# Altium project Makit_Car_Kit.PrjPcb (part 2 of 3)
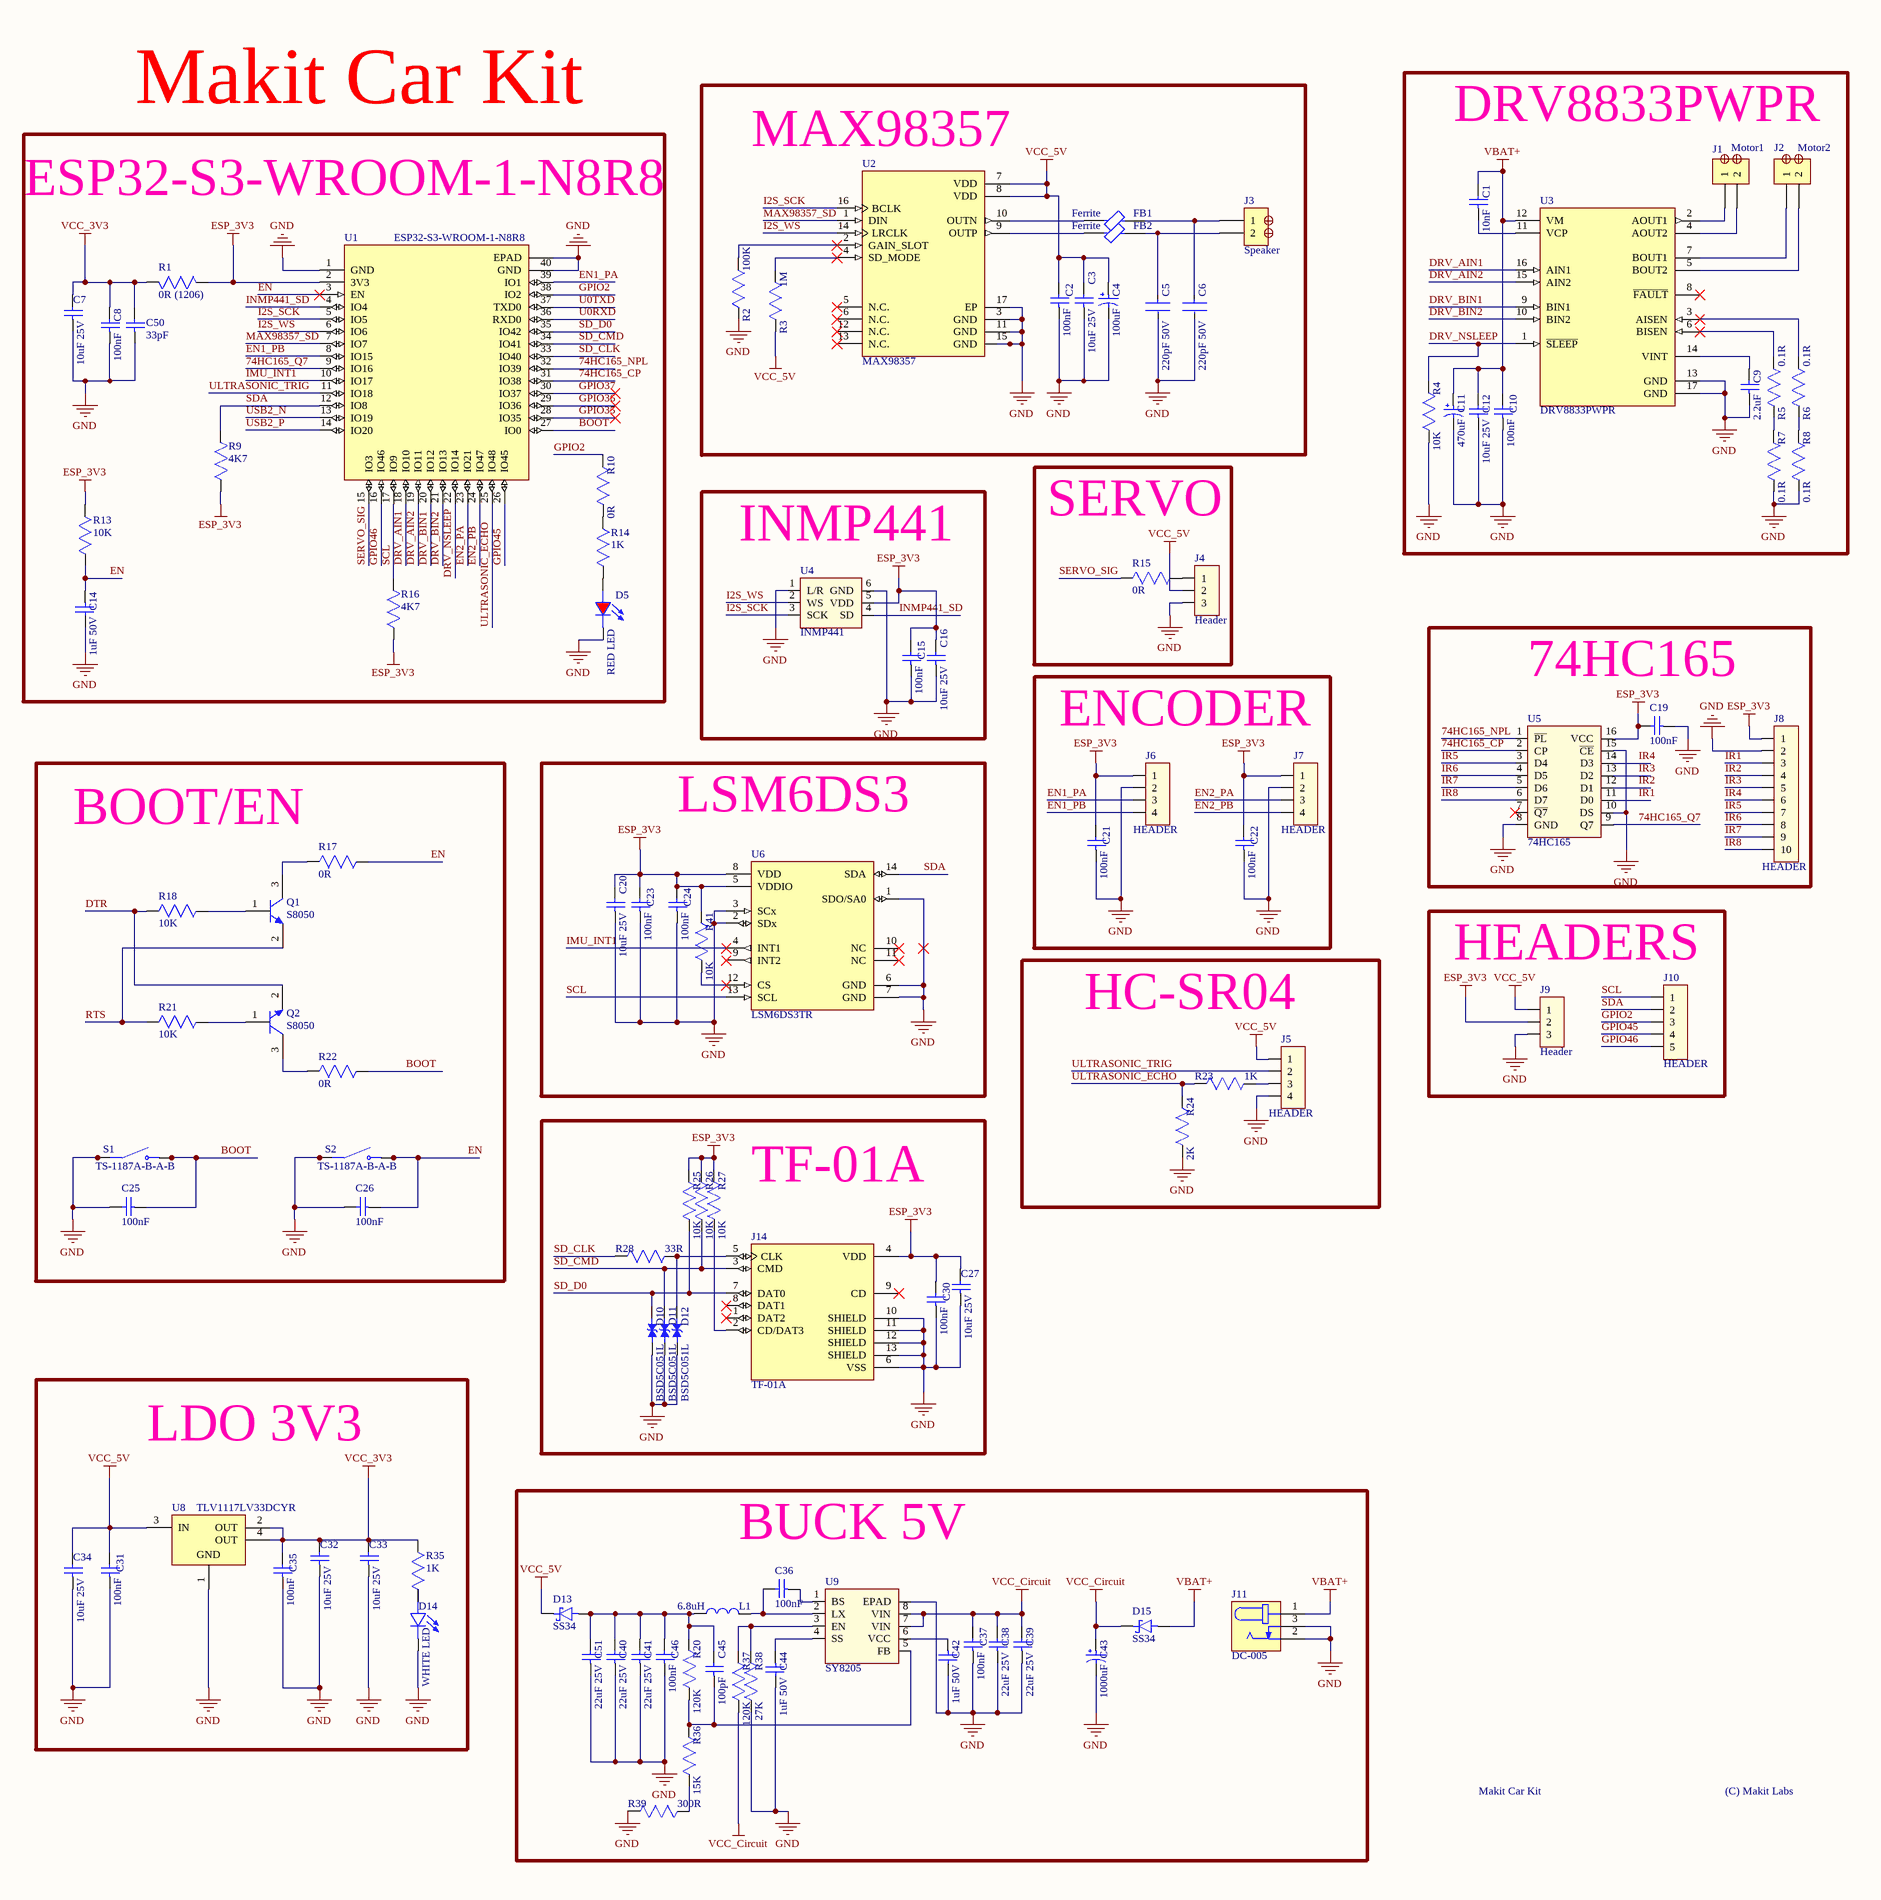
[diagram p2: Makit_Car_Kit.SchDoc, right]

## Sheet Makit_Car_Kit.SchDoc (continued)
### Library data of the parts
C1 = 0603B103K500NT: Ceramic Capacitor, Multilayer, Ceramic, 50V, 10% +Tol, 10% -Tol, X7R, 15% TC, 0.01uF, Surface Mount, 0603; Manufacturer: Knowles; Supplier: Mouser; Supplier Part Number: 843-0603B103K500NT; Manufacturer Part Number: 0603B103K500NT; Category: Ceramic Capacitors; Stock: 11050; Pricing: 1=1.01, 10=0.507, 50=0.507, 100=0.463, 1000=0.365, 10000=0.303 (USD); Value: 10nF; China RoHS: Non-Compliant; Country of Origin: Mainland China, USA; Dielectric Material: Ceramic; Export Control Classification Number (ECCN) Code: EAR99; Height: 889µm; Harmonized Tariff Schedule (HTS) Code: 8532.24.00.20; Introduction Date: 2006-04-10; Length: 1.52mm; Lifecycle Status: Production; Max Operating Temperature: 125°C; Min Operating Temperature: -55°C; Mounting Technology: Surface Mount; Number of Terminals: 2; REACH SVHC: No; RoHS: Non-Compliant; Voltage Rating (DC): 50V; Width: 762µm; ComponentLink1URL: https://datasheet.octopart.com:443/0603B103K500NT-Knowles-datasheet-136501453.pdf?src-supplier=RFMW; ComponentLink1Description: https://datasheet.octopart.com:443/0603B103K500NT-Knowles-datasheet-136501453.pdf?src-supplier=RFMW; ComponentLink2URL: https://datasheet.octopart.com:443/0603B103K500NT-Knowles-datasheet-137194379.pdf?src-supplier=Component+Distributors+Inc.; ComponentLink2Description: https://datasheet.octopart.com:443/0603B103K500NT-Knowles-datasheet-137194379.pdf?src-supplier=Component+Distributors+Inc.; ComponentLink3URL: https://datasheet.octopart.com:443/0603B103K500NT-Knowles-datasheet-23628174.pdf?src-supplier=Component+Distributors+Inc.; ComponentLink3Description: https://datasheet.octopart.com:443/0603B103K500NT-Knowles-datasheet-23628174.pdf?src-supplier=Component+Distributors+Inc.; Package: 0603; JLCPCB Part Number: C57112
C2 C8 C10 C15 C17-C19 C21-C26 C30 C31 C35-C37 C46 = CC0603KRX7R9BB104: Multilayer Ceramic Capacitor, CC Series, 0.1 - F, - 10%, X7R, 50 V, 0603 [1608 Metric]; Manufacturer: Yageo Group; Voltage: 50V; Supplier: Avnet; Supplier Part Number: CC0603KRX7R9BB104; Manufacturer Part Number: CC0603KRX7R9BB104; RoHS: Compliant; Category: Ceramic Capacitors; Stock: 6088000; Pricing: 4000=0.00582, 8000=0.00559, 16000=0.00541, 32000=0.00522, 64000=0.00504 (USD); Value: 100nF; Case/Package: 0603; Case Code (Imperial): 0603; Case Code (Metric): 1608; China RoHS: Compliant; Country of Origin: Mainland China, Taiwan; Depth: 800µm; Dielectric: X7R; Dielectric Material: Ceramic; Export Control Classification Number (ECCN) Code: EAR99; Halogen Free: Halogen Free; Height: 800µm; Harmonized Tariff Schedule (HTS) Code: 8532.24.00.20; Introduction Date: 2005-08-18; Lead Free: Lead Free; Length: 1.6mm; Lifecycle Status: Production; Material: Ceramic; Max Operating Temperature: 125°C; Min Operating Temperature: -55°C; Mounting Technology: Surface Mount; Pins: 2; Number of Terminals: 2; Radiation Hardening: No; REACH SVHC: Yes; Schedule B: 8532240020, 8532240020|8532240020, 8532240020|8532240020|8532240020, 8532240020|8532240020|8532240020|8532240020; Termination: SMD/SMT; Thickness: 889µm; Tolerance: 10%; Voltage Rating: 50V; Voltage Rating (DC): 50V; Width: 800µm; ComponentLink1URL: https://datasheet.octopart.com:443/CC0603KRX7R9BB104-Yageo-datasheet-177165144.pdf?src-supplier=IHS; ComponentLink1Description: https://datasheet.octopart.com:443/CC0603KRX7R9BB104-Yageo-datasheet-177165144.pdf?src-supplier=IHS; ComponentLink2URL: https://datasheet.octopart.com:443/CC0603KRX7R9BB104-Yageo-datasheet-82288757.pdf?src-supplier=Upverter; ComponentLink2Description: https://datasheet.octopart.com:443/CC0603KRX7R9BB104-Yageo-datasheet-82288757.pdf?src-supplier=Upverter; ComponentLink3URL: https://datasheet.octopart.com:443/CC0603KRX7R9BB104-Yageo-datasheet-68298032.pdf?src-supplier=Upverter; ComponentLink3Description: https://datasheet.octopart.com:443/CC0603KRX7R9BB104-Yageo-datasheet-68298032.pdf?src-supplier=Upverter; ComponentLink4URL: https://datasheet.octopart.com:443/CC0603KRX7R9BB104-Yageo-Group-datasheet-189192896.pdf?src-supplier=Future+Electronics; ComponentLink4Description: https://datasheet.octopart.com:443/CC0603KRX7R9BB104-Yageo-Group-datasheet-189192896.pdf?src-supplier=Future+Electronics; ComponentLink5URL: https://datasheet.octopart.com:443/CC0603KRX7R9BB104-Yageo-datasheet-12526321.pdf?src-supplier=Future+Electronics; ComponentLink5Description: https://datasheet.octopart.com:443/CC0603KRX7R9BB104-Yageo-datasheet-12526321.pdf?src-supplier=Future+Electronics; ComponentLink6URL: https://datasheet.octopart.com:443/CC0603KRX7R9BB104-Yageo-datasheet-166511530.pdf?src-supplier=Future+Electronics; ComponentLink6Description: https://datasheet.octopart.com:443/CC0603KRX7R9BB104-Yageo-datasheet-166511530.pdf?src-supplier=Future+Electronics; ComponentLink7URL: https://datasheet.octopart.com:443/CC0603KRX7R9BB104-Yageo-datasheet-137700082.pdf?src-supplier=Future+Electronics; ComponentLink7Description: https://datasheet.octopart.com:443/CC0603KRX7R9BB104-Yageo-datasheet-137700082.pdf?src-supplier=Future+Electronics; ComponentLink8URL: https://datasheet.octopart.com:443/CC0603KRX7R9BB104-Yageo-datasheet-137700084.pdf?src-supplier=Future+Electronics; ComponentLink8Description: https://datasheet.octopart.com:443/CC0603KRX7R9BB104-Yageo-datasheet-137700084.pdf?src-supplier=Future+Electronics; ComponentLink9URL: https://datasheet.octopart.com:443/CC0603KRX7R9BB104-Yageo-datasheet-27626582.pdf?src-supplier=Future+Electronics; ComponentLink9Description: https://datasheet.octopart.com:443/CC0603KRX7R9BB104-Yageo-datasheet-27626582.pdf?src-supplier=Future+Electronics; ComponentLink10URL: https://datasheet.octopart.com:443/CC0603KRX7R9BB104-Yageo-datasheet-15895757.pdf?src-supplier=Future+Electronics; ComponentLink10Description: https://datasheet.octopart.com:443/CC0603KRX7R9BB104-Yageo-datasheet-15895757.pdf?src-supplier=Future+Electronics; ComponentLink11URL: https://datasheet.octopart.com:443/CC0603KRX7R9BB104-Yageo-datasheet-8324192.pdf?src-supplier=Future+Electronics; ComponentLink11Description: https://datasheet.octopart.com:443/CC0603KRX7R9BB104-Yageo-datasheet-8324192.pdf?src-supplier=Future+Electronics; ComponentLink12URL: https://datasheet.octopart.com/CC0603KRX7R9BB104-Yageo-datasheet-10883670.pdf; ComponentLink12Description: https://datasheet.octopart.com/CC0603KRX7R9BB104-Yageo-datasheet-10883670.pdf; ComponentLink13URL: https://datasheet.octopart.com:443/CC0603KRX7R9BB104-Yageo-datasheet-181968726.pdf?src-supplier=Newark; ComponentLink13Description: https://datasheet.octopart.com:443/CC0603KRX7R9BB104-Yageo-datasheet-181968726.pdf?src-supplier=Newark; ComponentLink14URL: https://datasheet.octopart.com:443/CC0603KRX7R9BB104-Yageo-datasheet-499490.pdf?src-supplier=Newark; ComponentLink14Description: https://datasheet.octopart.com:443/CC0603KRX7R9BB104-Yageo-datasheet-499490.pdf?src-supplier=Newark; ComponentLink15URL: https://datasheet.octopart.com:443/CC0603KRX7R9BB104-Yageo-datasheet-62336348.pdf?src-supplier=Newark; ComponentLink15Description: https://datasheet.octopart.com:443/CC0603KRX7R9BB104-Yageo-datasheet-62336348.pdf?src-supplier=Newark; ComponentLink16URL: https://datasheet.octopart.com:443/CC0603KRX7R9BB104-Yageo-datasheet-147453679.pdf?src-supplier=Newark; ComponentLink16Description: https://datasheet.octopart.com:443/CC0603KRX7R9BB104-Yageo-datasheet-147453679.pdf?src-supplier=Newark; ComponentLink17URL: https://datasheet.octopart.com:443/CC0603KRX7R9BB104-Yageo-datasheet-151948686.pdf?src-supplier=Farnell; ComponentLink17Description: https://datasheet.octopart.com:443/CC0603KRX7R9BB104-Yageo-datasheet-151948686.pdf?src-supplier=Farnell; ComponentLink18URL: https://datasheet.octopart.com:443/CC0603KRX7R9BB104-Yageo-datasheet-500777.pdf?src-supplier=Farnell; ComponentLink18Description: https://datasheet.octopart.com:443/CC0603KRX7R9BB104-Yageo-datasheet-500777.pdf?src-supplier=Farnell; ComponentLink19URL: https://datasheet.octopart.com:443/CC0603KRX7R9BB104-Yageo-datasheet-178019014.pdf?src-supplier=Burklin+Elektronik; ComponentLink19Description: https://datasheet.octopart.com:443/CC0603KRX7R9BB104-Yageo-datasheet-178019014.pdf?src-supplier=Burklin+Elektronik; ComponentLink20URL: https://datasheet.octopart.com:443/CC0603KRX7R9BB104-Yageo-Group-datasheet-165992755.pdf?src-supplier=ODG+(Origin+Data+Global); ComponentLink20Description: https://datasheet.octopart.com:443/CC0603KRX7R9BB104-Yageo-Group-datasheet-165992755.pdf?src-supplier=ODG+(Origin+Data+Global); ComponentLink21URL: https://datasheet.octopart.com:443/CC0603KRX7R9BB104-Yageo-datasheet-140260305.pdf?src-supplier=SOS+electronic; ComponentLink21Description: https://datasheet.octopart.com:443/CC0603KRX7R9BB104-Yageo-datasheet-140260305.pdf?src-supplier=SOS+electronic; ComponentLink22URL: https://datasheet.octopart.com:443/CC0603KRX7R9BB104-Yageo-datasheet-120101875.pdf?src-supplier=Megastar; ComponentLink22Description: https://datasheet.octopart.com:443/CC0603KRX7R9BB104-Yageo-datasheet-120101875.pdf?src-supplier=Megastar; ComponentLink23URL: https://datasheet.octopart.com:443/CC0603KRX7R9BB104-Yageo-datasheet-8701427.pdf?src-supplier=element14; ComponentLink23Description: https://datasheet.octopart.com:443/CC0603KRX7R9BB104-Yageo-datasheet-8701427.pdf?src-supplier=element14; ComponentLink24URL: https://datasheet.octopart.com:443/CC0603KRX7R9BB104-Yageo-datasheet-5301394.pdf?src-supplier=element14; ComponentLink24Description: https://datasheet.octopart.com:443/CC0603KRX7R9BB104-Yageo-datasheet-5301394.pdf?src-supplier=element14; ComponentLink25URL: https://datasheet.octopart.com:443/CC0603KRX7R9BB104-Yageo-datasheet-17600895.pdf?src-supplier=TME; ComponentLink25Description: https://datasheet.octopart.com:443/CC0603KRX7R9BB104-Yageo-datasheet-17600895.pdf?src-supplier=TME; ComponentLink26URL: http://sigma.octopart.com:80/15889575/rohs_statement/Yageo-CC0603KRX7R9BB104.pdf?src-supplier=Compliance+Statements; ComponentLink26Description: http://sigma.octopart.com:80/15889575/rohs_statement/Yageo-CC0603KRX7R9BB104.pdf?src-supplier=Compliance+Statements; ComponentLink27URL: http://sigma.octopart.com:80/conflict_mineral_statement/Yageo-company-3.pdf?src-supplier=Compliance+Statements; ComponentLink27Description: http://sigma.octopart.com:80/conflict_mineral_statement/Yageo-company-3.pdf?src-supplier=Compliance+Statements; JLCPCB Part Number: C14663
C3 C7 C12 C13 C16 C20 C27 C28 C32-C34 = CL10A106MA8NRNC: 25V 10uF X5R ±20% 0603 Multilayer Ceramic Capacitors MLCC - SMD/SMT ROHS; Manufacturer: Samsung Electro-Mechanics; Value: 10µF; Supplier: Avnet; Supplier Part Number: CL10A106MA8NRNC; Manufacturer Part Number: CL10A106MA8NRNC; RoHS: Compliant; Category: Ceramic Capacitors; Stock: 6860000; Pricing: 4000=0.03585, 8000=0.03513, 16000=0.03443, 32000=0.03377, 64000=0.03313 (USD); Case/Package: 0603; Case Code (Imperial): 0603; Case Code (Metric): 1608; China RoHS: Compliant; Contact Plating: Tin; Country of Origin: Mainland China, Philippines, South Korea; Dielectric: X5R; Dielectric Material: Ceramic; Export Control Classification Number (ECCN) Code: EAR99; Height: 800µm; Harmonized Tariff Schedule (HTS) Code: 8532.24.00.20; Introduction Date: 2013-01-16; Lead Free: Lead Free; Length: 1.6mm; Lifecycle Status: Production; Material: Ceramic; Max Operating Temperature: 85°C; Min Operating Temperature: -55°C; Mounting Technology: Surface Mount; Number of Terminals: 2; Packaging: Tape & Reel (TR); REACH SVHC: Yes; Schedule B: 8532240020, 8532240020|8532240020|8532240020|8532240020|8532240020|8532240020|8532240020|8532240020|8532240020|8532240020|8532240020, 8532240020|8532240020|8532240020|8532240020|8532240020|8532240020|8532240020|8532240020|8532240020|8532240020|8532240020|8532240020, 8532240020|8532240020|8532240020|8532240020|8532240020|8532240020|8532240020|8532240020|8532240020|8532240020|8532240020|8532240020|8532240020; Termination: Wraparound; Thickness: 889µm; Tolerance: 20%; Voltage Rating: 25V; Voltage Rating (DC): 25V; Width: 800µm; ComponentLink1URL: https://datasheet.octopart.com:443/CL10A106MA8NRNC-Samsung-Electro-Mechanics-datasheet-182019172.pdf?src-supplier=IHS; ComponentLink1Description: https://datasheet.octopart.com:443/CL10A106MA8NRNC-Samsung-Electro-Mechanics-datasheet-182019172.pdf?src-supplier=IHS; ComponentLink2URL: https://datasheet.octopart.com:443/CL10A106MA8NRNC-Samsung-Electro-Mechanics-datasheet-137745063.pdf?src-supplier=Future+Electronics; ComponentLink2Description: https://datasheet.octopart.com:443/CL10A106MA8NRNC-Samsung-Electro-Mechanics-datasheet-137745063.pdf?src-supplier=Future+Electronics; ComponentLink3URL: https://datasheet.octopart.com:443/CL10A106MA8NRNC-Samsung-Electro-Mechanics-datasheet-136031756.pdf?src-supplier=Future+Electronics; ComponentLink3Description: https://datasheet.octopart.com:443/CL10A106MA8NRNC-Samsung-Electro-Mechanics-datasheet-136031756.pdf?src-supplier=Future+Electronics; ComponentLink4URL: https://datasheet.octopart.com:443/CL10A106MA8NRNC-Samsung-Electro-Mechanics-datasheet-110226291.pdf?src-supplier=Future+Electronics; ComponentLink4Description: https://datasheet.octopart.com:443/CL10A106MA8NRNC-Samsung-Electro-Mechanics-datasheet-110226291.pdf?src-supplier=Future+Electronics; ComponentLink5URL: https://datasheet.octopart.com:443/CL10A106MA8NRNC-Samsung-Electro-Mechanics-datasheet-87580073.pdf?src-supplier=Future+Electronics; ComponentLink5Description: https://datasheet.octopart.com:443/CL10A106MA8NRNC-Samsung-Electro-Mechanics-datasheet-87580073.pdf?src-supplier=Future+Electronics; ComponentLink6URL: https://datasheet.octopart.com:443/CL10A106MA8NRNC-Samsung-Electro-Mechanics-datasheet-68300265.pdf?src-supplier=Future+Electronics; ComponentLink6Description: https://datasheet.octopart.com:443/CL10A106MA8NRNC-Samsung-Electro-Mechanics-datasheet-68300265.pdf?src-supplier=Future+Electronics; ComponentLink7URL: https://datasheet.octopart.com:443/CL10A106MA8NRNC-Samsung-datasheet-66660282.pdf?src-supplier=Future+Electronics; ComponentLink7Description: https://datasheet.octopart.com:443/CL10A106MA8NRNC-Samsung-datasheet-66660282.pdf?src-supplier=Future+Electronics; ComponentLink8URL: https://datasheet.octopart.com:443/CL10A106MA8NRNC-Samsung-datasheet-48647236.pdf?src-supplier=Future+Electronics; ComponentLink8Description: https://datasheet.octopart.com:443/CL10A106MA8NRNC-Samsung-datasheet-48647236.pdf?src-supplier=Future+Electronics; ComponentLink9URL: https://datasheet.octopart.com:443/CL10A106MA8NRNC-Samsung-datasheet-39118733.pdf?src-supplier=Future+Electronics; ComponentLink9Description: https://datasheet.octopart.com:443/CL10A106MA8NRNC-Samsung-datasheet-39118733.pdf?src-supplier=Future+Electronics; ComponentLink10URL: https://datasheet.octopart.com:443/CL10A106MA8NRNC-Samsung-Electro-Mechanics-datasheet-149156483.pdf?src-supplier=Future+Electronics; ComponentLink10Description: https://datasheet.octopart.com:443/CL10A106MA8NRNC-Samsung-Electro-Mechanics-datasheet-149156483.pdf?src-supplier=Future+Electronics; JLCPCB Part Number: C96446
C4 = ERS1EM101E11OT: 100uF 25V ±20% Plugin, D6.3xL11mm Aluminum Electrolytic Capacitors - Leaded ROHS; Manufacturer: AISHI; Value: 100µF; Leakage Current: 25µA; Ripple Current: 140mA; Supplier: Future Electronics; Supplier Part Number: 1125307; Manufacturer Part Number: ERS1EM101E11OT; RoHS: Compliant; Category: Aluminum Electrolytic Capacitors; Pricing: 1000=0.0251, 5000=0.0242, 12500=0.0238, 37500=0.0232, 75000=0.0224 (USD); Diameter: 6.3mm; Length: 11mm; Max Operating Temperature: 105°C; Min Operating Temperature: -40°C; Number of Terminals: 2; Packaging: Bulk; REACH SVHC: Yes; Terminal Pitch: 2.5mm; Voltage Rating (DC): 25V; ComponentLink1URL: https://datasheet.octopart.com:443/ERS1EM101E11OT-AISHI-datasheet-182031447.pdf?src-supplier=IHS; ComponentLink1Description: https://datasheet.octopart.com:443/ERS1EM101E11OT-AISHI-datasheet-182031447.pdf?src-supplier=IHS; ComponentLink2URL: https://datasheet.octopart.com:443/ERS1EM101E11OT-AISHI-datasheet-153668799.pdf?src-supplier=Master+Electronics; ComponentLink2Description: https://datasheet.octopart.com:443/ERS1EM101E11OT-AISHI-datasheet-153668799.pdf?src-supplier=Master+Electronics; ComponentLink3URL: https://datasheet.octopart.com:443/ERS1EM101E11OT-AISHI-datasheet-141413433.pdf?src-supplier=Future+Electronics; ComponentLink3Description: https://datasheet.octopart.com:443/ERS1EM101E11OT-AISHI-datasheet-141413433.pdf?src-supplier=Future+Electronics
C5 C6 = CMP-13271-000087-1: Cap Ceramic 220pF 50V X7R ±10% Pad SMD 0603 +125°C T/R; Voltage Rating: 50V; Case Code (Metric): 1608; Radiation Hardening: No; Dielectric: X7R; Mount: Surface Mount; Length: 1.6mm; Thickness: 0.035inch; Packaging: Tape and Reel; Height: 0.8mm; Depth: 0.8mm; Tolerance: 10%; Width: 0.031inch; Case Code (Imperial): 0603; Voltage: 50V; Material: Ceramic; Case/Package: 0603; Capacitance: 220pF; Max Operating Temperature: 125°C; Min Operating Temperature: -55°C; Contact Plating: Tin; JLCPCB Part Number: C1603
C9 C47 = CL10A225KO8NNNC: 16V 2.2uF X5R ±10% 0603 Multilayer Ceramic Capacitors MLCC - SMD/SMT ROHS; Manufacturer: Samsung Electro-Mechanics; Value: 2.2µF; Supplier: Avnet; Supplier Part Number: CL10A225KO8NNNC; Manufacturer Part Number: CL10A225KO8NNNC; RoHS: Compliant; Category: Ceramic Capacitors; Stock: 260000; Pricing: 4000=0.00673, 8000=0.0066, 16000=0.00647, 32000=0.00635, 64000=0.00624 (USD); Case/Package: 0603; Case Code (Imperial): 0603; Case Code (Metric): 1608; China RoHS: Compliant; Contact Plating: Tin; Country of Origin: Mainland China, Philippines, South Korea; Depth: 800µm; Dielectric: X5R; Dielectric Material: Ceramic; Export Control Classification Number (ECCN) Code: EAR99; Height: 900µm; Harmonized Tariff Schedule (HTS) Code: 8532.24.00.20; Introduction Date: 2007-03-23; Lead Free: Lead Free; Length: 1.6mm; Lifecycle Status: Production; Material: Ceramic; Max Operating Temperature: 85°C; Min Operating Temperature: -55°C; Mounting Technology: Surface Mount; Number of Terminals: 2; Radiation Hardening: No; REACH SVHC: Yes; Schedule B: 8532240020, 8532240020|8532240020|8532240020|8532240020|8532240020|8532240020|8532240020|8532240020|8532240020|8532240020|8532240020|8532240020|8532240020|8532240020|8532240020|8532240020|8532240020|8532240020|8532240020|8532240020|8532240020|8532240020|8532240020|85; Thickness: 889µm; Tolerance: 10%; Voltage: 16V; Voltage Rating: 16V; Voltage Rating (DC): 16V; Width: 800µm; ComponentLink1URL: https://datasheet.octopart.com:443/CL10A225KO8NNNC-Samsung-Electro-Mechanics-datasheet-136031763.pdf?src-supplier=IHS; ComponentLink1Description: https://datasheet.octopart.com:443/CL10A225KO8NNNC-Samsung-Electro-Mechanics-datasheet-136031763.pdf?src-supplier=IHS; ComponentLink2URL: https://datasheet.octopart.com/CL10A225KO8NNNC-Samsung-Electro-Mechanics-datasheet-8324245.pdf; ComponentLink2Description: https://datasheet.octopart.com/CL10A225KO8NNNC-Samsung-Electro-Mechanics-datasheet-8324245.pdf; ComponentLink3URL: https://datasheet.octopart.com/CL10A225KO8NNNC-Samsung-Electro-Mechanics-datasheet-97040617.pdf; ComponentLink3Description: https://datasheet.octopart.com/CL10A225KO8NNNC-Samsung-Electro-Mechanics-datasheet-97040617.pdf; ComponentLink4URL: https://datasheet.octopart.com/General-Multilayer-Ceramic-Capacitors-Samsung-datasheet-family-111.pdf; ComponentLink4Description: https://datasheet.octopart.com/General-Multilayer-Ceramic-Capacitors-Samsung-datasheet-family-111.pdf; ComponentLink5URL: https://datasheet.octopart.com:443/CL10A225KO8NNNC-Samsung-Electro-Mechanics-datasheet-110326828.pdf?src-supplier=Future+Electronics; ComponentLink5Description: https://datasheet.octopart.com:443/CL10A225KO8NNNC-Samsung-Electro-Mechanics-datasheet-110326828.pdf?src-supplier=Future+Electronics; ComponentLink6URL: https://datasheet.octopart.com:443/CL10A225KO8NNNC-Samsung-Electro-Mechanics-datasheet-81461797.pdf?src-supplier=Future+Electronics; ComponentLink6Description: https://datasheet.octopart.com:443/CL10A225KO8NNNC-Samsung-Electro-Mechanics-datasheet-81461797.pdf?src-supplier=Future+Electronics; ComponentLink7URL: https://datasheet.octopart.com:443/CL10A225KO8NNNC-Samsung-datasheet-48647245.pdf?src-supplier=Future+Electronics; ComponentLink7Description: https://datasheet.octopart.com:443/CL10A225KO8NNNC-Samsung-datasheet-48647245.pdf?src-supplier=Future+Electronics; ComponentLink8URL: https://datasheet.octopart.com:443/CL10A225KO8NNNC-Samsung-datasheet-26589124.pdf?src-supplier=Future+Electronics; ComponentLink8Description: https://datasheet.octopart.com:443/CL10A225KO8NNNC-Samsung-datasheet-26589124.pdf?src-supplier=Future+Electronics; ComponentLink9URL: https://datasheet.octopart.com:443/CL10A225KO8NNNC-Samsung-Electro-Mechanics-datasheet-149156492.pdf?src-supplier=Future+Electronics; ComponentLink9Description: https://datasheet.octopart.com:443/CL10A225KO8NNNC-Samsung-Electro-Mechanics-datasheet-149156492.pdf?src-supplier=Future+Electronics; ComponentLink10URL: https://datasheet.octopart.com:443/CL10A225KO8NNNC-Samsung-Electro-Mechanics-datasheet-11768396.pdf?src-supplier=Arrow+Electronics; ComponentLink10Description: https://datasheet.octopart.com:443/CL10A225KO8NNNC-Samsung-Electro-Mechanics-datasheet-11768396.pdf?src-supplier=Arrow+Electronics; ComponentLink11URL: https://datasheet.octopart.com:443/CL10A225KO8NNNC-Samsung-datasheet-59220082.pdf?src-supplier=TME; ComponentLink11Description: https://datasheet.octopart.com:443/CL10A225KO8NNNC-Samsung-datasheet-59220082.pdf?src-supplier=TME; ComponentLink12URL: http://sigma.octopart.com:80/rohs_certificate/General-Multilayer-Ceramic-Capacitors-Samsung-family-110.pdf?src-supplier=Compliance+Statements; ComponentLink12Description: http://sigma.octopart.com:80/rohs_certificate/General-Multilayer-Ceramic-Capacitors-Samsung-family-110.pdf?src-supplier=Compliance+Statements; ComponentLink13URL: http://sigma.octopart.com:80/rohs_statement/General-Multilayer-Ceramic-Capacitors-Samsung-family-132.pdf?src-supplier=Compliance+Statements; ComponentLink13Description: http://sigma.octopart.com:80/rohs_statement/General-Multilayer-Ceramic-Capacitors-Samsung-family-132.pdf?src-supplier=Compliance+Statements; ComponentLink14URL: http://sigma.octopart.com:80/reach_statement/General-Multilayer-Ceramic-Capacitors-Samsung-family-133.pdf?src-supplier=Compliance+Statements; ComponentLink14Description: http://sigma.octopart.com:80/reach_statement/General-Multilayer-Ceramic-Capacitors-Samsung-family-133.pdf?src-supplier=Compliance+Statements; JLCPCB Part Number: C23630
C11 = 25YXF470MEFC10X16: Radial Can ALUMINUM ELECTROLYTIC CAPACITOR YXF 25V 470muF 卤20% 0.394Dia 10.00mm; Manufacturer: Rubycon; Value: 470µF; Dielectric Material: Aluminium; Impedance: 120mΩ; Leakage Current: 117.5µA; Life (Hours): 7000hours; Ripple Current: 577.5mA; Tolerance: 20%; Supplier: Arrow Electronics; Supplier Part Number: 25YXF470MEFC10X16; Manufacturer Part Number: 25YXF470MEFC10X16; RoHS: Compliant; Category: Aluminum Electrolytic Capacitors; Case/Package: Radial; Diameter: 10mm; Height: 16mm; Height - Seated (Max): 17.5006mm; Lead Free: Lead Free; Lead Pitch: 5mm; Length: 16mm; Lifecycle Status: Obsolete; Max Operating Temperature: 105°C; Min Operating Temperature: -40°C; Mounting Technology: Through Hole; Pins: 2; Number of Terminals: 2; Packaging: Bulk; Radiation Hardening: No; REACH SVHC: Yes; Schedule B: 8532220020; Terminal Pitch: 5mm; Termination: Radial; Voltage Rating: 25V; Voltage Rating (DC): 25V; ComponentLink1URL: https://datasheet.octopart.com:443/25YXF470MEFC10X16-Rubycon-datasheet-182101233.pdf?src-supplier=IHS; ComponentLink1Description: https://datasheet.octopart.com:443/25YXF470MEFC10X16-Rubycon-datasheet-182101233.pdf?src-supplier=IHS; ComponentLink2URL: https://datasheet.octopart.com:443/25YXF470MEFC10X16-Rubycon-datasheet-12512315.pdf?src-supplier=LKR; ComponentLink2Description: https://datasheet.octopart.com:443/25YXF470MEFC10X16-Rubycon-datasheet-12512315.pdf?src-supplier=LKR; ComponentLink3URL: https://datasheet.octopart.com:443/25YXF470MEFC10X16-Rubycon-datasheet-11966930.pdf?src-supplier=element14+APAC; ComponentLink3Description: https://datasheet.octopart.com:443/25YXF470MEFC10X16-Rubycon-datasheet-11966930.pdf?src-supplier=element14+APAC; ComponentLink4URL: https://datasheet.octopart.com:443/25YXF470MEFC10X16-Rubycon-datasheet-10032391.pdf?src-supplier=element14+APAC; ComponentLink4Description: https://datasheet.octopart.com:443/25YXF470MEFC10X16-Rubycon-datasheet-10032391.pdf?src-supplier=element14+APAC; ComponentLink5URL: https://datasheet.octopart.com:443/25YXF470MEFC10X16-Rubycon-datasheet-8447018.pdf?src-supplier=element14+APAC; ComponentLink5Description: https://datasheet.octopart.com:443/25YXF470MEFC10X16-Rubycon-datasheet-8447018.pdf?src-supplier=element14+APAC; ComponentLink6URL: https://datasheet.octopart.com:443/25YXF470MEFC10X16-Rubycon-datasheet-5377913.pdf?src-supplier=element14+APAC; ComponentLink6Description: https://datasheet.octopart.com:443/25YXF470MEFC10X16-Rubycon-datasheet-5377913.pdf?src-supplier=element14+APAC; ComponentLink7URL: https://datasheet.octopart.com:443/25YXF470MEFC10X16-Rubycon-datasheet-66579749.pdf?src-supplier=element14+APAC; ComponentLink7Description: https://datasheet.octopart.com:443/25YXF470MEFC10X16-Rubycon-datasheet-66579749.pdf?src-supplier=element14+APAC; ComponentLink8URL: https://datasheet.octopart.com:443/25YXF470MEFC10X16-Rubycon-datasheet-154786052.pdf?src-supplier=JRH+Electronics; ComponentLink8Description: https://datasheet.octopart.com:443/25YXF470MEFC10X16-Rubycon-datasheet-154786052.pdf?src-supplier=JRH+Electronics; ComponentLink9URL: https://datasheet.octopart.com:443/25YXF470MEFC10X16-Rubycon-datasheet-86451560.pdf?src-supplier=Farnell; ComponentLink9Description: https://datasheet.octopart.com:443/25YXF470MEFC10X16-Rubycon-datasheet-86451560.pdf?src-supplier=Farnell; ComponentLink10URL: https://datasheet.octopart.com:443/25YXF470MEFC10X16-Rubycon-datasheet-41194730.pdf?src-supplier=Farnell; ComponentLink10Description: https://datasheet.octopart.com:443/25YXF470MEFC10X16-Rubycon-datasheet-41194730.pdf?src-supplier=Farnell; ComponentLink11URL: https://datasheet.octopart.com:443/25YXF470MEFC10X16-Rubycon-datasheet-504709.pdf?src-supplier=Farnell; ComponentLink11Description: https://datasheet.octopart.com:443/25YXF470MEFC10X16-Rubycon-datasheet-504709.pdf?src-supplier=Farnell; ComponentLink12URL: https://datasheet.octopart.com:443/25YXF470MEFC10X16-Rubycon-datasheet-155906919.pdf?src-supplier=Future+Electronics; ComponentLink12Description: https://datasheet.octopart.com:443/25YXF470MEFC10X16-Rubycon-datasheet-155906919.pdf?src-supplier=Future+Electronics; ComponentLink13URL: https://datasheet.octopart.com:443/25YXF470MEFC10X16-Rubycon-datasheet-5377475.pdf?src-supplier=Garrett; ComponentLink13Description: https://datasheet.octopart.com:443/25YXF470MEFC10X16-Rubycon-datasheet-5377475.pdf?src-supplier=Garrett
C14 C29 C42 C44 = CL10A105KB8NNNC: 50V 1uF X5R ±10% 0603 Multilayer Ceramic Capacitors MLCC - SMD/SMT ROHS; Manufacturer: Samsung Electro-Mechanics; Value: 1µF; Supplier: Avnet; Supplier Part Number: CL10A105KB8NNNC; Manufacturer Part Number: CL10A105KB8NNNC; RoHS: Compliant; Category: Ceramic Capacitors; Stock: 1808000; Pricing: 4000=0.01018, 8000=0.00997, 16000=0.00978, 32000=0.00959, 64000=0.00941 (USD); Case/Package: 0603; Case Code (Imperial): 0603; Case Code (Metric): 1608; China RoHS: Compliant; Contact Plating: Tin; Depth: 800µm; Dielectric: X5R; Dielectric Material: Ceramic; Height: 900µm; Length: 1.6mm; Lifecycle Status: Production; Material: Ceramic; Max Operating Temperature: 85°C; Min Operating Temperature: -55°C; Mounting Technology: Surface Mount; Number of Terminals: 2; Packaging: Tape & Reel (TR); Radiation Hardening: No; REACH SVHC: Yes; Schedule B: 8532240020, 8532240020|8532240020|8532240020|8532240020|8532240020|8532240020|8532240020|8532240020|8532240020|8532240020|8532240020|8532240020|8532240020|8532240020|8532240020|8532240020|8532240020|8532240020|8532240020|8532240020|8532240020|8532240020|8532240020|85; Termination: Wraparound; Thickness: 889µm; Tolerance: 10%; Voltage Rating: 50V; Voltage Rating (DC): 50V; Width: 800µm; ComponentLink1URL: https://datasheet.octopart.com:443/CL10A105KB8NNNC-Samsung-Electro-Mechanics-datasheet-182019146.pdf?src-supplier=IHS; ComponentLink1Description: https://datasheet.octopart.com:443/CL10A105KB8NNNC-Samsung-Electro-Mechanics-datasheet-182019146.pdf?src-supplier=IHS; ComponentLink2URL: https://datasheet.octopart.com:443/CL10A105KB8NNNC-Samsung-Electro-Mechanics-datasheet-136031745.pdf?src-supplier=Samsung+SCT; ComponentLink2Description: https://datasheet.octopart.com:443/CL10A105KB8NNNC-Samsung-Electro-Mechanics-datasheet-136031745.pdf?src-supplier=Samsung+SCT; ComponentLink3URL: https://datasheet.octopart.com:443/CL10A105KB8NNNC-Samsung-Electro-Mechanics-datasheet-110326821.pdf?src-supplier=Future+Electronics; ComponentLink3Description: https://datasheet.octopart.com:443/CL10A105KB8NNNC-Samsung-Electro-Mechanics-datasheet-110326821.pdf?src-supplier=Future+Electronics; ComponentLink4URL: https://datasheet.octopart.com:443/CL10A105KB8NNNC-Samsung-Electro-Mechanics-datasheet-81461777.pdf?src-supplier=Future+Electronics; ComponentLink4Description: https://datasheet.octopart.com:443/CL10A105KB8NNNC-Samsung-Electro-Mechanics-datasheet-81461777.pdf?src-supplier=Future+Electronics; ComponentLink5URL: https://datasheet.octopart.com:443/CL10A105KB8NNNC-Samsung-datasheet-42485232.pdf?src-supplier=Future+Electronics; ComponentLink5Description: https://datasheet.octopart.com:443/CL10A105KB8NNNC-Samsung-datasheet-42485232.pdf?src-supplier=Future+Electronics; ComponentLink6URL: https://datasheet.octopart.com:443/CL10A105KB8NNNC-Samsung-datasheet-26589110.pdf?src-supplier=Future+Electronics; ComponentLink6Description: https://datasheet.octopart.com:443/CL10A105KB8NNNC-Samsung-datasheet-26589110.pdf?src-supplier=Future+Electronics; ComponentLink7URL: https://datasheet.octopart.com:443/CL10A105KB8NNNC-Samsung-datasheet-8328790.pdf?src-supplier=Future+Electronics; ComponentLink7Description: https://datasheet.octopart.com:443/CL10A105KB8NNNC-Samsung-datasheet-8328790.pdf?src-supplier=Future+Electronics; ComponentLink8URL: https://datasheet.octopart.com:443/CL10A105KB8NNNC-Samsung-Electro-Mechanics-datasheet-149156476.pdf?src-supplier=Future+Electronics; ComponentLink8Description: https://datasheet.octopart.com:443/CL10A105KB8NNNC-Samsung-Electro-Mechanics-datasheet-149156476.pdf?src-supplier=Future+Electronics; ComponentLink9URL: https://datasheet.octopart.com/CL10A105KB8NNNC-Samsung-Electro-Mechanics-datasheet-97040617.pdf; ComponentLink9Description: https://datasheet.octopart.com/CL10A105KB8NNNC-Samsung-Electro-Mechanics-datasheet-97040617.pdf; ComponentLink10URL: https://datasheet.octopart.com/CL10A105KB8NNNC-Samsung-Electro-Mechanics-datasheet-8324245.pdf; ComponentLink10Description: https://datasheet.octopart.com/CL10A105KB8NNNC-Samsung-Electro-Mechanics-datasheet-8324245.pdf; ComponentLink11URL: https://datasheet.octopart.com/General-Multilayer-Ceramic-Capacitors-Samsung-datasheet-family-111.pdf; ComponentLink11Description: https://datasheet.octopart.com/General-Multilayer-Ceramic-Capacitors-Samsung-datasheet-family-111.pdf; ComponentLink12URL: https://datasheet.octopart.com:443/CL10A105KB8NNNC-Samsung-datasheet-59220082.pdf?src-supplier=TME; ComponentLink12Description: https://datasheet.octopart.com:443/CL10A105KB8NNNC-Samsung-datasheet-59220082.pdf?src-supplier=TME; ComponentLink13URL: http://sigma.octopart.com:80/rohs_certificate/General-Multilayer-Ceramic-Capacitors-Samsung-family-110.pdf?src-supplier=Compliance+Statements; ComponentLink13Description: http://sigma.octopart.com:80/rohs_certificate/General-Multilayer-Ceramic-Capacitors-Samsung-family-110.pdf?src-supplier=Compliance+Statements; ComponentLink14URL: http://sigma.octopart.com:80/rohs_statement/General-Multilayer-Ceramic-Capacitors-Samsung-family-132.pdf?src-supplier=Compliance+Statements; ComponentLink14Description: http://sigma.octopart.com:80/rohs_statement/General-Multilayer-Ceramic-Capacitors-Samsung-family-132.pdf?src-supplier=Compliance+Statements; ComponentLink15URL: http://sigma.octopart.com:80/reach_statement/General-Multilayer-Ceramic-Capacitors-Samsung-family-133.pdf?src-supplier=Compliance+Statements; ComponentLink15Description: http://sigma.octopart.com:80/reach_statement/General-Multilayer-Ceramic-Capacitors-Samsung-family-133.pdf?src-supplier=Compliance+Statements; JLCPCB Part Number: C15849
C38-C41 C51 = CL31A226KAHNNNE: 25V 22uF X5R ±10% 1206 Multilayer Ceramic Capacitors MLCC - SMD/SMT ROHS; Manufacturer: Samsung Electro-Mechanics; Value: 22µF; Supplier: Avnet; Supplier Part Number: CL31A226KAHNNNE; Manufacturer Part Number: CL31A226KAHNNNE; RoHS: Compliant; Category: Ceramic Capacitors; Stock: 458000; Pricing: 2000=0.06023, 4000=0.05902, 8000=0.05786, 16000=0.05674, 32000=0.05566 (USD); Case/Package: 1206; Case Code (Imperial): 1206; Case Code (Metric): 3216; China RoHS: Compliant; Contact Plating: Tin; Depth: 1.6mm; Dielectric: X5R; Dielectric Material: Ceramic; Height: 1.8mm; Length: 3.2mm; Lifecycle Status: Production; Material: Ceramic; Max Operating Temperature: 85°C; Min Operating Temperature: -55°C; Mounting Technology: Surface Mount; Number of Terminals: 2; Radiation Hardening: No; REACH SVHC: Yes; Schedule B: 8532240020, 8532240020|8532240020|8532240020|8532240020|8532240020|8532240020|8532240020|8532240020|8532240020|8532240020|8532240020|8532240020|8532240020|8532240020|8532240020|8532240020|8532240020|8532240020|8532240020|8532240020|8532240020|8532240020|8532240020|85; Thickness: 1.8034mm; Tolerance: 10%; Voltage Rating: 25V; Voltage Rating (DC): 25V; Width: 1.6mm; ComponentLink1URL: https://datasheet.octopart.com:443/CL31A226KAHNNNE-Samsung-Electro-Mechanics-datasheet-182024232.pdf?src-supplier=IHS; ComponentLink1Description: https://datasheet.octopart.com:443/CL31A226KAHNNNE-Samsung-Electro-Mechanics-datasheet-182024232.pdf?src-supplier=IHS; ComponentLink2URL: https://datasheet.octopart.com:443/CL31A226KAHNNNE-Samsung-Electro-Mechanics-datasheet-136322594.pdf?src-supplier=Upverter; ComponentLink2Description: https://datasheet.octopart.com:443/CL31A226KAHNNNE-Samsung-Electro-Mechanics-datasheet-136322594.pdf?src-supplier=Upverter; ComponentLink3URL: https://datasheet.octopart.com:443/CL31A226KAHNNNE-Samsung-datasheet-11719069.pdf?src-supplier=Future+Electronics; ComponentLink3Description: https://datasheet.octopart.com:443/CL31A226KAHNNNE-Samsung-datasheet-11719069.pdf?src-supplier=Future+Electronics; ComponentLink4URL: https://datasheet.octopart.com:443/CL31A226KAHNNNE-Samsung-Electro-Mechanics-datasheet-149066826.pdf?src-supplier=Future+Electronics; ComponentLink4Description: https://datasheet.octopart.com:443/CL31A226KAHNNNE-Samsung-Electro-Mechanics-datasheet-149066826.pdf?src-supplier=Future+Electronics; ComponentLink5URL: https://datasheet.octopart.com:443/CL31A226KAHNNNE-Samsung-Electro-Mechanics-datasheet-110334154.pdf?src-supplier=Future+Electronics; ComponentLink5Description: https://datasheet.octopart.com:443/CL31A226KAHNNNE-Samsung-Electro-Mechanics-datasheet-110334154.pdf?src-supplier=Future+Electronics; ComponentLink6URL: https://datasheet.octopart.com:443/CL31A226KAHNNNE-Samsung-Electro-Mechanics-datasheet-81462435.pdf?src-supplier=Future+Electronics; ComponentLink6Description: https://datasheet.octopart.com:443/CL31A226KAHNNNE-Samsung-Electro-Mechanics-datasheet-81462435.pdf?src-supplier=Future+Electronics; ComponentLink7URL: https://datasheet.octopart.com:443/CL31A226KAHNNNE-Samsung-datasheet-12535148.pdf?src-supplier=Future+Electronics; ComponentLink7Description: https://datasheet.octopart.com:443/CL31A226KAHNNNE-Samsung-datasheet-12535148.pdf?src-supplier=Future+Electronics; ComponentLink8URL: https://datasheet.octopart.com:443/CL31A226KAHNNNE-Samsung-Electro-Mechanics-datasheet-37081328.pdf?src-supplier=Future+Electronics; ComponentLink8Description: https://datasheet.octopart.com:443/CL31A226KAHNNNE-Samsung-Electro-Mechanics-datasheet-37081328.pdf?src-supplier=Future+Electronics; ComponentLink9URL: https://datasheet.octopart.com/CL31A226KAHNNNE-Samsung-Electro-Mechanics-datasheet-97040617.pdf; ComponentLink9Description: https://datasheet.octopart.com/CL31A226KAHNNNE-Samsung-Electro-Mechanics-datasheet-97040617.pdf; ComponentLink10URL: https://datasheet.octopart.com/CL31A226KAHNNNE-Samsung-Electro-Mechanics-datasheet-8324245.pdf; ComponentLink10Description: https://datasheet.octopart.com/CL31A226KAHNNNE-Samsung-Electro-Mechanics-datasheet-8324245.pdf; ComponentLink11URL: https://datasheet.octopart.com:443/CL31A226KAHNNNE-Samsung-datasheet-8326407.pdf?src-supplier=TME; ComponentLink11Description: https://datasheet.octopart.com:443/CL31A226KAHNNNE-Samsung-datasheet-8326407.pdf?src-supplier=TME; Package: 1206; JLCPCB Part Number: C12891; Manufacturer_Part_Number: CL31A226KAHNNNE
C43 = 25PX1000MEFC10X16: Radial Can ALUMINUM ELECTROLYTIC CAPACITOR PX 25V 1000uF ±20% 0.394Dia 10.00mm; Manufacturer: Rubycon; Leakage Current: 250µA; Life (Hours): 2000hours; Polarity: Polar; Ripple Current: 740mA; Supplier: DigiKey; Supplier Part Number: 1189-3681-ND; Manufacturer Part Number: 25PX1000MEFC10X16; RoHS: Compliant; Category: Aluminum Electrolytic Capacitors; Stock: 34; Pricing: 1=0.69, 10=0.433, 50=0.3236, 100=0.2888, 500=0.22892, 1000=0.21, 3000=0.18634, 5000=0.17749 (USD); Value: 1000uF; Case/Package: Radial; Country of Origin: Japan; Diameter: 10mm; Export Control Classification Number (ECCN) Code: EAR99; Height: 16mm; Height - Seated (Max): 17.4752mm; Harmonized Tariff Schedule (HTS) Code: 8532.22.00.20; Introduction Date: 2011-09-22; Lead Pitch: 5mm; Length: 16mm; Lifecycle Status: Production; Max Operating Temperature: 105°C; Min Operating Temperature: -55°C; Mounting Technology: Through Hole; Pins: 2; Number of Terminals: 2; Packaging: Bulk; Radiation Hardening: No; REACH SVHC: Yes; Terminal Pitch: 5mm; Termination: Radial; Tolerance: 20%; Voltage Rating: 25V; Voltage Rating (DC): 25V; ComponentLink1URL: https://datasheet.octopart.com:443/25PX1000MEFC10X16-Rubycon-datasheet-159569471.pdf?src-supplier=IHS; ComponentLink1Description: https://datasheet.octopart.com:443/25PX1000MEFC10X16-Rubycon-datasheet-159569471.pdf?src-supplier=IHS; ComponentLink2URL: https://datasheet.octopart.com:443/25PX1000MEFC10X16-Rubycon-datasheet-86451557.pdf?src-supplier=Master+Electronics; ComponentLink2Description: https://datasheet.octopart.com:443/25PX1000MEFC10X16-Rubycon-datasheet-86451557.pdf?src-supplier=Master+Electronics; ComponentLink3URL: https://datasheet.octopart.com:443/25PX1000MEFC10X16-Rubycon-datasheet-41169268.pdf?src-supplier=Farnell; ComponentLink3Description: https://datasheet.octopart.com:443/25PX1000MEFC10X16-Rubycon-datasheet-41169268.pdf?src-supplier=Farnell; ComponentLink4URL: https://datasheet.octopart.com:443/25PX1000MEFC10X16-Rubycon-datasheet-12529491.pdf?src-supplier=Future+Electronics; ComponentLink4Description: https://datasheet.octopart.com:443/25PX1000MEFC10X16-Rubycon-datasheet-12529491.pdf?src-supplier=Future+Electronics; ComponentLink5URL: https://datasheet.octopart.com:443/25PX1000MEFC10X16-Rubycon-datasheet-155906914.pdf?src-supplier=Future+Electronics; ComponentLink5Description: https://datasheet.octopart.com:443/25PX1000MEFC10X16-Rubycon-datasheet-155906914.pdf?src-supplier=Future+Electronics
C45 = CL10C101JB8NNNC: 50V 100pF C0G ±5% 0603 Multilayer Ceramic Capacitors MLCC - SMD/SMT ROHS; Manufacturer: Samsung Electro-Mechanics; Number of Channels: 1; Temperature Coefficient: 30ppm/°C; Supplier: Avnet; Supplier Part Number: CL10C101JB8NNNC; Manufacturer Part Number: CL10C101JB8NNNC; RoHS: Compliant; Category: Ceramic Capacitors; Stock: 2170876; Pricing: 4000=0.00295, 8000=0.00289, 16000=0.00283, 32000=0.00278, 64000=0.00273 (USD); Value: 100pF; Case/Package: 0603; Case Code (Imperial): 0603; Case Code (Metric): 1608; China RoHS: Compliant; Contact Plating: Tin; Country of Origin: Mainland China, Philippines, South Korea; Depth: 800µm; Dielectric: C0G; Dielectric Material: Ceramic; Export Control Classification Number (ECCN) Code: EAR99; Height: 900µm; Harmonized Tariff Schedule (HTS) Code: 8532.24.00.20; Introduction Date: 2010-02-10; Lead Free: Lead Free; Length: 1.6mm; Lifecycle Status: Production; Material: Ceramic; Max Operating Temperature: 125°C; Min Operating Temperature: -55°C; Mounting Technology: Surface Mount; Number of Terminals: 2; Radiation Hardening: No; REACH SVHC: Yes; Schedule B: 8532240020, 8532240020|8532240020, 8532240020|8532240020|8532240020, 8532240020|8532240020|8532240020|8532240020; Thickness: 889µm; Tolerance: 5%; Voltage: 50V; Voltage Rating: 50V; Voltage Rating (DC): 50V; Width: 800µm; ComponentLink1URL: https://datasheet.octopart.com:443/CL10C101JB8NNNC-Samsung-Electro-Mechanics-datasheet-136482390.pdf?src-supplier=IHS; ComponentLink1Description: https://datasheet.octopart.com:443/CL10C101JB8NNNC-Samsung-Electro-Mechanics-datasheet-136482390.pdf?src-supplier=IHS; ComponentLink2URL: https://datasheet.octopart.com/CL10C101JB8NNNC-Samsung-Electro-Mechanics-datasheet-8324245.pdf; ComponentLink2Description: https://datasheet.octopart.com/CL10C101JB8NNNC-Samsung-Electro-Mechanics-datasheet-8324245.pdf; ComponentLink3URL: https://datasheet.octopart.com/CL10C101JB8NNNC-Samsung-Electro-Mechanics-datasheet-97040617.pdf; ComponentLink3Description: https://datasheet.octopart.com/CL10C101JB8NNNC-Samsung-Electro-Mechanics-datasheet-97040617.pdf; ComponentLink4URL: https://datasheet.octopart.com:443/CL10C101JB8NNNC-Samsung-Electro-Mechanics-datasheet-110326842.pdf?src-supplier=Future+Electronics; ComponentLink4Description: https://datasheet.octopart.com:443/CL10C101JB8NNNC-Samsung-Electro-Mechanics-datasheet-110326842.pdf?src-supplier=Future+Electronics; ComponentLink5URL: https://datasheet.octopart.com:443/CL10C101JB8NNNC-Samsung-Electro-Mechanics-datasheet-81461969.pdf?src-supplier=Future+Electronics; ComponentLink5Description: https://datasheet.octopart.com:443/CL10C101JB8NNNC-Samsung-Electro-Mechanics-datasheet-81461969.pdf?src-supplier=Future+Electronics; ComponentLink6URL: https://datasheet.octopart.com:443/CL10C101JB8NNNC-Samsung-datasheet-12521739.pdf?src-supplier=Future+Electronics; ComponentLink6Description: https://datasheet.octopart.com:443/CL10C101JB8NNNC-Samsung-datasheet-12521739.pdf?src-supplier=Future+Electronics; ComponentLink7URL: https://datasheet.octopart.com:443/CL10C101JB8NNNC-Samsung-datasheet-26669111.pdf?src-supplier=Future+Electronics; ComponentLink7Description: https://datasheet.octopart.com:443/CL10C101JB8NNNC-Samsung-datasheet-26669111.pdf?src-supplier=Future+Electronics; ComponentLink8URL: https://datasheet.octopart.com:443/CL10C101JB8NNNC-Samsung-datasheet-8328827.pdf?src-supplier=Future+Electronics; ComponentLink8Description: https://datasheet.octopart.com:443/CL10C101JB8NNNC-Samsung-datasheet-8328827.pdf?src-supplier=Future+Electronics; ComponentLink9URL: https://datasheet.octopart.com:443/CL10C101JB8NNNC-Samsung-Electro-Mechanics-datasheet-149154131.pdf?src-supplier=Future+Electronics; ComponentLink9Description: https://datasheet.octopart.com:443/CL10C101JB8NNNC-Samsung-Electro-Mechanics-datasheet-149154131.pdf?src-supplier=Future+Electronics; ComponentLink10URL: https://datasheet.octopart.com:443/CL10C101JB8NNNC-Samsung-datasheet-8326407.pdf?src-supplier=TME; ComponentLink10Description: https://datasheet.octopart.com:443/CL10C101JB8NNNC-Samsung-datasheet-8326407.pdf?src-supplier=TME; JLCPCB Part Number: C14858
C48 C49 = CL10C150JB8NNNC: Multilayer Ceramic Capacitor, 15 pF, 50 V, ± 5%, C0G (NP0), 0603 [1608 Metric]; Manufacturer: Samsung Electro-Mechanics; Temperature Coefficient: 30ppm/°C; Voltage: 50V; Supplier: Avnet; Supplier Part Number: CL10C150JB8NNNC; Manufacturer Part Number: CL10C150JB8NNNC; RoHS: Compliant; Category: Ceramic Capacitors; Stock: 224000; Pricing: 4000=0.00469, 8000=0.0046, 16000=0.00451, 32000=0.00442, 64000=0.00434 (USD); Value: 15pF; Case/Package: 0603; Case Code (Imperial): 0603; Case Code (Metric): 1608; China RoHS: Compliant; Contact Plating: Tin; Country of Origin: Mainland China, Philippines, South Korea; Depth: 800µm; Dielectric: C0G; Dielectric Material: Ceramic; Export Control Classification Number (ECCN) Code: EAR99; Height: 900µm; Harmonized Tariff Schedule (HTS) Code: 8532.24.00.20; Introduction Date: 2010-02-10; Lead Free: Lead Free; Length: 1.6mm; Lifecycle Status: Production; Material: Ceramic; Max Operating Temperature: 125°C; Min Operating Temperature: -55°C; Mounting Technology: Surface Mount; Number of Terminals: 2; Radiation Hardening: No; REACH SVHC: Yes; Schedule B: 8532240020, 8532240020|8532240020, 8532240020|8532240020|8532240020, 8532240020|8532240020|8532240020|8532240020; Thickness: 889µm; Tolerance: 5%; Voltage Rating: 50V; Voltage Rating (DC): 50V; Width: 800µm; ComponentLink1URL: https://datasheet.octopart.com:443/CL10C150JB8NNNC-Samsung-Electro-Mechanics-datasheet-136482401.pdf?src-supplier=IHS; ComponentLink1Description: https://datasheet.octopart.com:443/CL10C150JB8NNNC-Samsung-Electro-Mechanics-datasheet-136482401.pdf?src-supplier=IHS; ComponentLink2URL: https://datasheet.octopart.com/CL10C150JB8NNNC-Samsung-Electro-Mechanics-datasheet-8324245.pdf; ComponentLink2Description: https://datasheet.octopart.com/CL10C150JB8NNNC-Samsung-Electro-Mechanics-datasheet-8324245.pdf; ComponentLink3URL: https://datasheet.octopart.com/CL10C150JB8NNNC-Samsung-Electro-Mechanics-datasheet-97040617.pdf; ComponentLink3Description: https://datasheet.octopart.com/CL10C150JB8NNNC-Samsung-Electro-Mechanics-datasheet-97040617.pdf; ComponentLink4URL: https://datasheet.octopart.com/General-Multilayer-Ceramic-Capacitors-Samsung-datasheet-family-111.pdf; ComponentLink4Description: https://datasheet.octopart.com/General-Multilayer-Ceramic-Capacitors-Samsung-datasheet-family-111.pdf; ComponentLink5URL: https://datasheet.octopart.com:443/CL10C150JB8NNNC-Samsung-Electro-Mechanics-datasheet-110326846.pdf?src-supplier=Future+Electronics; ComponentLink5Description: https://datasheet.octopart.com:443/CL10C150JB8NNNC-Samsung-Electro-Mechanics-datasheet-110326846.pdf?src-supplier=Future+Electronics; ComponentLink6URL: https://datasheet.octopart.com:443/CL10C150JB8NNNC-Samsung-Electro-Mechanics-datasheet-81461981.pdf?src-supplier=Future+Electronics; ComponentLink6Description: https://datasheet.octopart.com:443/CL10C150JB8NNNC-Samsung-Electro-Mechanics-datasheet-81461981.pdf?src-supplier=Future+Electronics; ComponentLink7URL: https://datasheet.octopart.com:443/CL10C150JB8NNNC-Samsung-datasheet-42280548.pdf?src-supplier=Future+Electronics; ComponentLink7Description: https://datasheet.octopart.com:443/CL10C150JB8NNNC-Samsung-datasheet-42280548.pdf?src-supplier=Future+Electronics; ComponentLink8URL: https://datasheet.octopart.com:443/CL10C150JB8NNNC-Samsung-datasheet-26669126.pdf?src-supplier=Future+Electronics; ComponentLink8Description: https://datasheet.octopart.com:443/CL10C150JB8NNNC-Samsung-datasheet-26669126.pdf?src-supplier=Future+Electronics; ComponentLink9URL: https://datasheet.octopart.com:443/CL10C150JB8NNNC-Samsung-Electro-Mechanics-datasheet-149154145.pdf?src-supplier=Future+Electronics; ComponentLink9Description: https://datasheet.octopart.com:443/CL10C150JB8NNNC-Samsung-Electro-Mechanics-datasheet-149154145.pdf?src-supplier=Future+Electronics; ComponentLink10URL: https://datasheet.octopart.com:443/CL10C150JB8NNNC-Samsung-datasheet-8326407.pdf?src-supplier=TME; ComponentLink10Description: https://datasheet.octopart.com:443/CL10C150JB8NNNC-Samsung-datasheet-8326407.pdf?src-supplier=TME; ComponentLink11URL: http://sigma.octopart.com:80/rohs_certificate/General-Multilayer-Ceramic-Capacitors-Samsung-family-110.pdf?src-supplier=Compliance+Statements; ComponentLink11Description: http://sigma.octopart.com:80/rohs_certificate/General-Multilayer-Ceramic-Capacitors-Samsung-family-110.pdf?src-supplier=Compliance+Statements; ComponentLink12URL: http://sigma.octopart.com:80/rohs_statement/General-Multilayer-Ceramic-Capacitors-Samsung-family-132.pdf?src-supplier=Compliance+Statements; ComponentLink12Description: http://sigma.octopart.com:80/rohs_statement/General-Multilayer-Ceramic-Capacitors-Samsung-family-132.pdf?src-supplier=Compliance+Statements; ComponentLink13URL: http://sigma.octopart.com:80/reach_statement/General-Multilayer-Ceramic-Capacitors-Samsung-family-133.pdf?src-supplier=Compliance+Statements; ComponentLink13Description: http://sigma.octopart.com:80/reach_statement/General-Multilayer-Ceramic-Capacitors-Samsung-family-133.pdf?src-supplier=Compliance+Statements